# EAGLE schematic Tryckgivare (EAGLE 7.5.0)
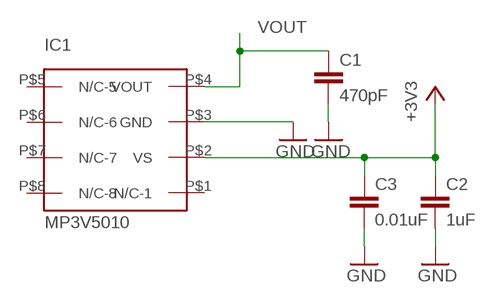
[diagram p0: schematic, sheet 1]

## Parts
C1  470pF  C-EUC0805  [C0805]
C2  1uF  C-EUC0805  [C0805]
C3  0.01uF  C-EUC0805  [C0805]
IC1  MP3V5010  [CASE1351]

## Nets
+3V3: C2.1 C3.1 IC1.P$2(VS)
GND: C1.2 C2.2 C3.2 IC1.P$3(GND)
VOUT: C1.1 IC1.P$4(VOUT)
Unconnected: IC1.P$1(N/C-1) IC1.P$5(N/C-5) IC1.P$6(N/C-6) IC1.P$7(N/C-7) IC1.P$8(N/C-8)

## Library data of the parts
C1-C3 = rcl:C-EU: CAPACITOR, European symbol
IC1 = MP3V5010DP:MP3V5010